# Altium schematic sheet rev02_25.SchDoc
size 282 x 200 mm
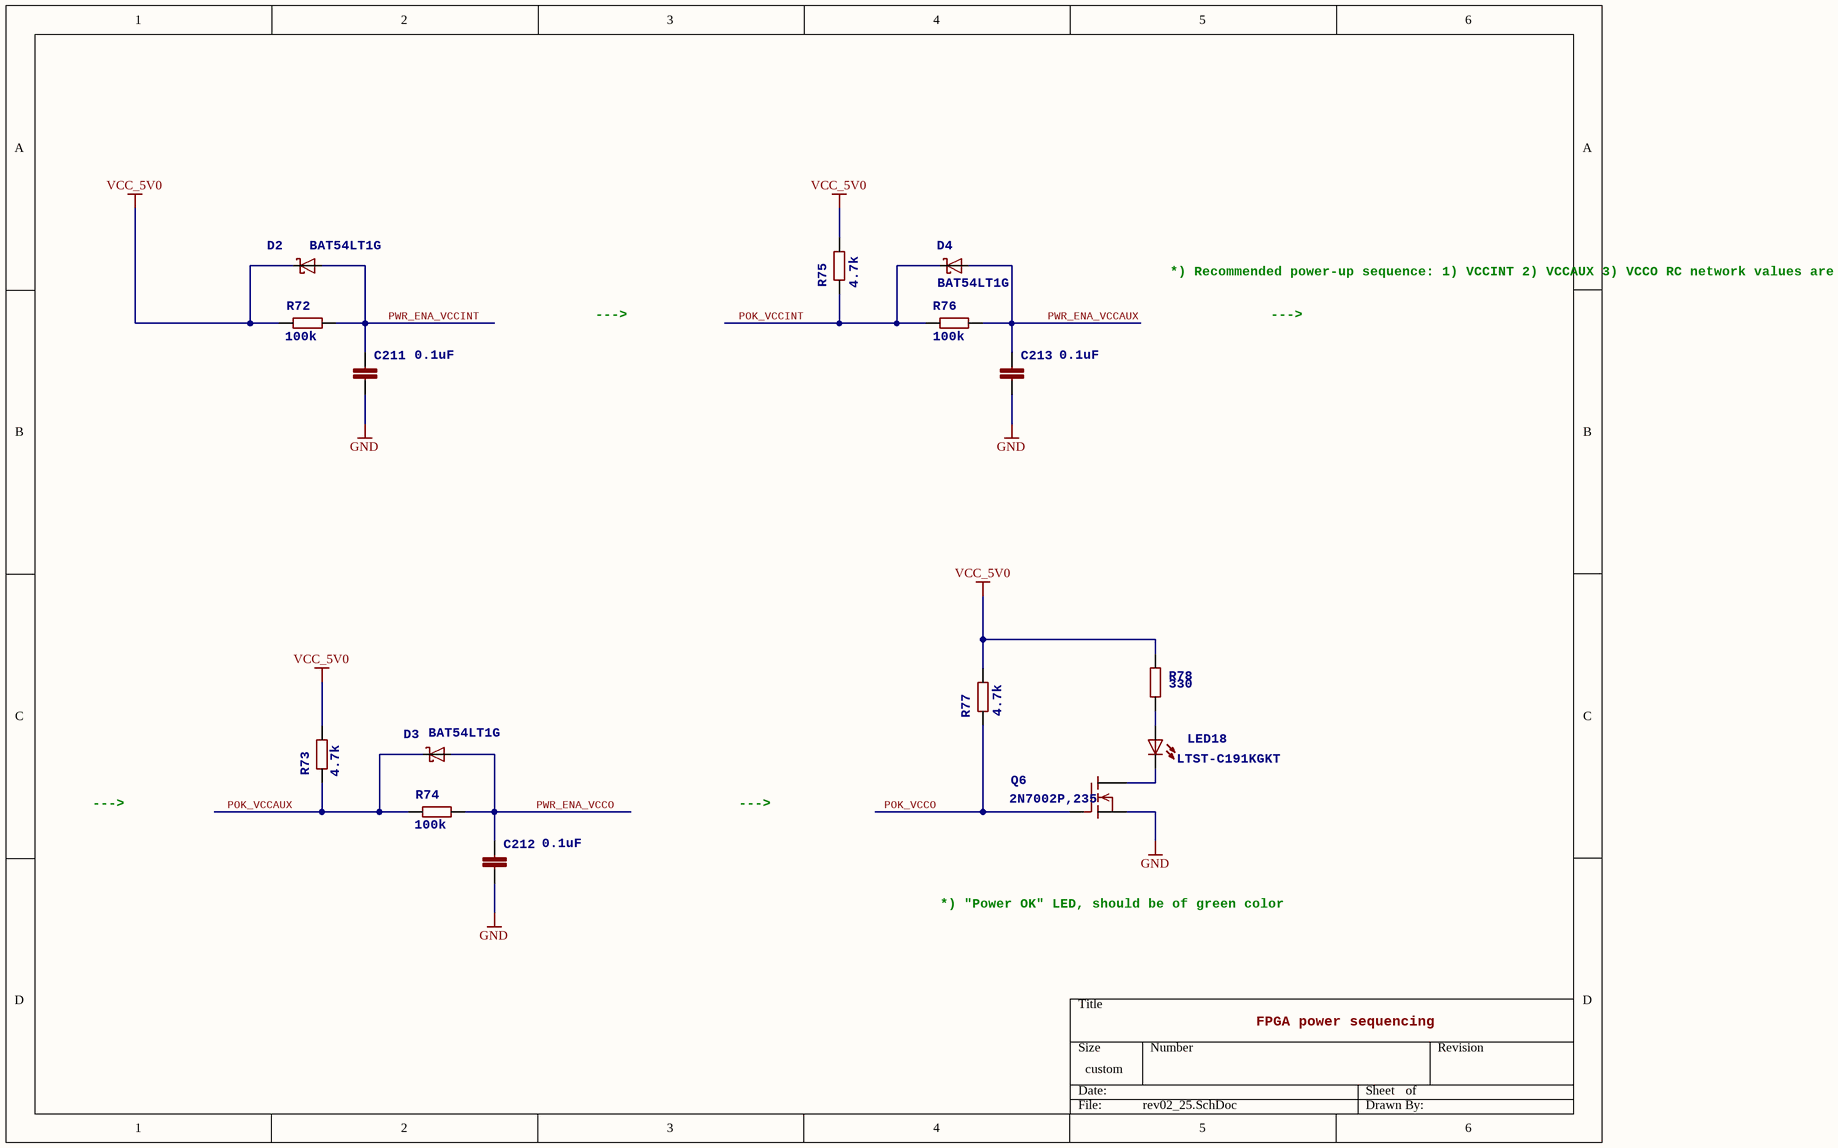
[diagram p0: rev02_25.SchDoc]

## Parts
C211  value 0.1uF  >NAME: C211  [C_0402]
C212  value 0.1uF  >NAME: C212  [C_0402]
C213  value 0.1uF  >NAME: C213  [C_0402]
D2  BAT54LT1G  >NAME: D2  [SOT-23]
D3  BAT54LT1G  >NAME: D3  [SOT-23]
D4  BAT54LT1G  >NAME: D4  [SOT-23]
LED18  LTST-C191KGKT  >NAME: LED18  [VD_0603]
Q6  2N7002P,235  >NAME: Q6  [SOT-23]
R72  value 100k  >NAME: R72  [R_0402]
R73  value 4.7k  >NAME: R73  [R_0402]
R74  value 100k  >NAME: R74  [R_0402]
R75  value 4.7k  >NAME: R75  [R_0402]
R76  value 100k  >NAME: R76  [R_0402]
R77  value 4.7k  >NAME: R77  [R_0402]
R78  value 330  >NAME: R78  [R_0402]

## Nets
GND: C211.2 C212.2 C213.2 Q6.2(S)
VCC_5V0: D2.3(C) R72.1 R73.2 R75.2 R77.2 R78.2
POK_VCCAUX: D3.3(C) R73.1 R74.1
POK_VCCINT: D4.3(C) R75.1 R76.1
POK_VCCO: Q6.1(G) R77.1
PWR_ENA_VCCAUX: C213.1 D4.1(A) R76.2
PWR_ENA_VCCINT: C211.1 D2.1(A) R72.2
PWR_ENA_VCCO: C212.1 D3.1(A) R74.2
NetLED18_1: LED18.1(A) R78.1
NetLED18_2: LED18.2(C) Q6.3(D)

## Notes on the sheet
- *) Recommended power-up sequence:
  1) VCCINT
  2) VCCAUX
  3) VCCO
  RC network values are preliminary,
  should be tweaked after experiments
- --->
- *) "Power OK" LED, should be of green color
- FPGA power sequencing

## Library data of the parts
C211-C213 = C-EUC0402: 0402 CAPACITOR; DIELECTRIC: X7R; RATED_VOLTAGE: 50V; TOLERANCE: 10%; >VALUE: 0.1 uF
D2-D4 = BAT54: OnSemi Schottky Diode; >VALUE: BAT54
LED18 = LEDCHIP-LED0603: GREEN LED
Q6 = 2N7002: OnSemi FET; >VALUE: 2N7002
R72 R74 R76 = R-EU_R0402: 0402 Resistor 1%; TOLERANCE: 1%
R73 R75 R77 R78 = R-EU_R0402: 0402 Resistor 5%; TOLERANCE: 5%